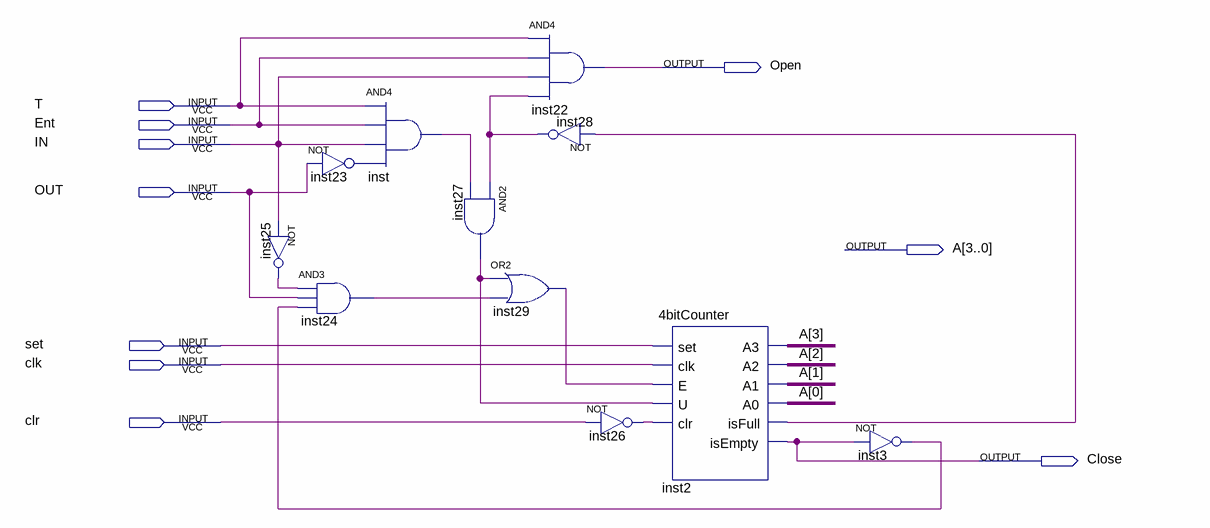
[diagram p0: schematic sheet]
// Quartus schematic waitingRoom.bdf as structural Verilog: 11 symbols, 10 pins
module waitingRoom (
  input  T,
  input  Ent,
  input  IN,
  input  OUT,
  input  set,
  input  clk,
  input  clr,
  output Open,
  output [3:0] A,
  output Close
);

  wire inst2_isfull, inst3_out, inst23_out, inst24_out, inst25_out, inst26_out, inst27_out, inst28_out,
       inst29_out, inst_out;

  not inst23 (inst23_out, OUT);
  not inst25 (inst25_out, IN);
  and inst24 (inst24_out, inst25_out, OUT, inst3_out);
  and inst (inst_out, T, Ent, IN, inst23_out);
  and inst27 (inst27_out, inst28_out, inst_out);
  and inst22 (Open, T, Ent, IN, inst28_out);
  not inst28 (inst28_out, inst2_isfull);
  or inst29 (inst29_out, inst27_out, inst24_out);
  not inst26 (inst26_out, clr);
  \4bitCounter  inst2 (
    .set(set), .clk(clk), .E(inst29_out), .U(inst27_out), .clr(inst26_out), .A3(A[3]), .A2(A[2]), .A1(A[1]),
    .A0(A[0]), .isFull(inst2_isfull), .isEmpty(Close));
  not inst3 (inst3_out, Close);
endmodule
